# EAGLE design bob (EAGLE 6.4)
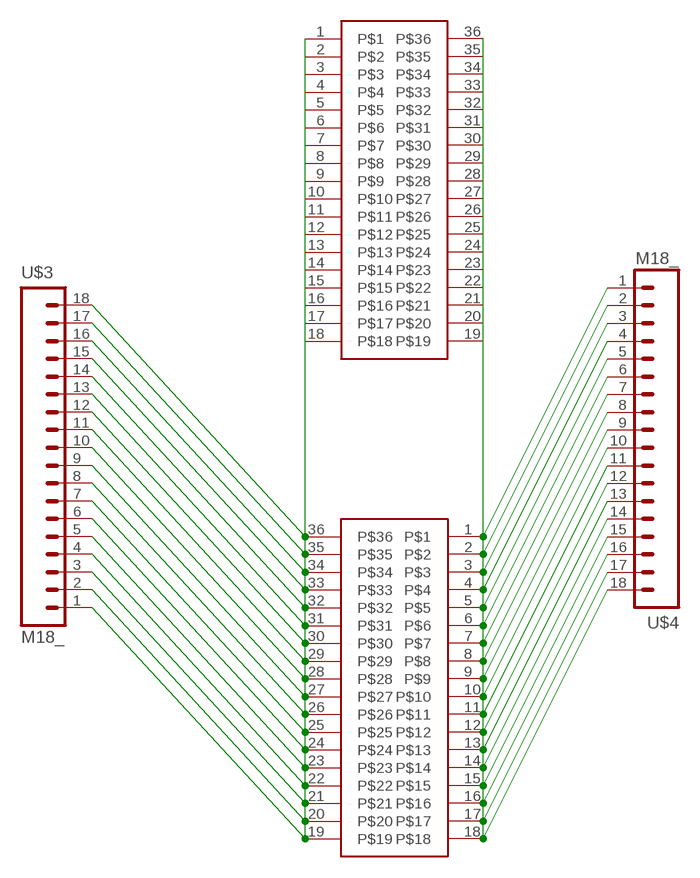
[diagram p0: schematic, sheet 1]

## Parts
U$1  36PIN_BREAKOUTSOIC  [SOIC-8-36-BREAKOUT]
U$2  36PIN_BREAKOUTTSSOP  [TSSOP-8-36-BREAKOUT]
U$3  M18_  [1X18]
U$4  M18_  [1X18]

## Nets
N$1: U$1.17 U$2.20 U$3.2
N$2: U$1.16 U$2.21 U$3.3
N$3: U$1.15 U$2.22 U$3.4
N$4: U$1.14 U$2.23 U$3.5
N$5: U$1.13 U$2.24 U$3.6
N$6: U$1.12 U$2.25 U$3.7
N$7: U$1.11 U$2.26 U$3.8
N$8: U$1.10 U$2.27 U$3.9
N$9: U$1.9 U$2.28 U$3.10
N$10: U$1.8 U$2.29 U$3.11
N$11: U$1.7 U$2.30 U$3.12
N$12: U$1.6 U$2.31 U$3.13
N$13: U$1.5 U$2.32 U$3.14
N$14: U$1.4 U$2.33 U$3.15
N$15: U$1.3 U$2.34 U$3.16
N$16: U$1.2 U$2.35 U$3.17
N$17: U$1.1 U$2.36 U$3.18
N$18: U$1.18 U$2.19 U$3.1
N$19: U$1.35 U$2.2 U$4.2
N$20: U$1.34 U$2.3 U$4.3
N$21: U$1.33 U$2.4 U$4.4
N$22: U$1.32 U$2.5 U$4.5
N$23: U$1.31 U$2.6 U$4.6
N$24: U$1.30 U$2.7 U$4.7
N$25: U$1.29 U$2.8 U$4.8
N$26: U$1.28 U$2.9 U$4.9
N$27: U$1.27 U$2.10 U$4.10
N$28: U$1.26 U$2.11 U$4.11
N$29: U$1.25 U$2.12 U$4.12
N$30: U$1.24 U$2.13 U$4.13
N$31: U$1.23 U$2.14 U$4.14
N$32: U$1.22 U$2.15 U$4.15
N$33: U$1.21 U$2.16 U$4.16
N$34: U$1.20 U$2.17 U$4.17
N$35: U$1.19 U$2.18 U$4.18
N$36: U$1.36 U$2.1 U$4.1

## Library data of the parts
U$1 U$2 = kmod:36PIN_BREAKOUT
U$3 U$4 = SparkFun-Connectors:M18: 1x18 .1" header

## Board
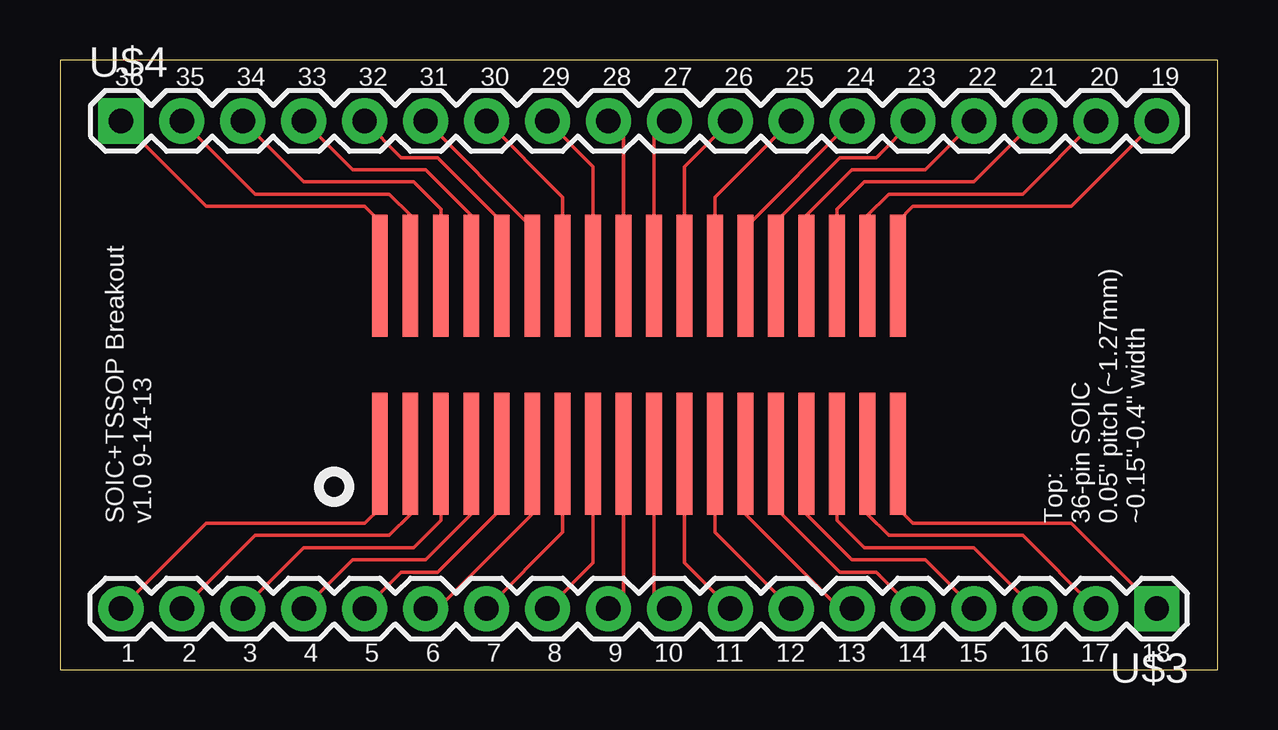
[diagram p1: board, top side]
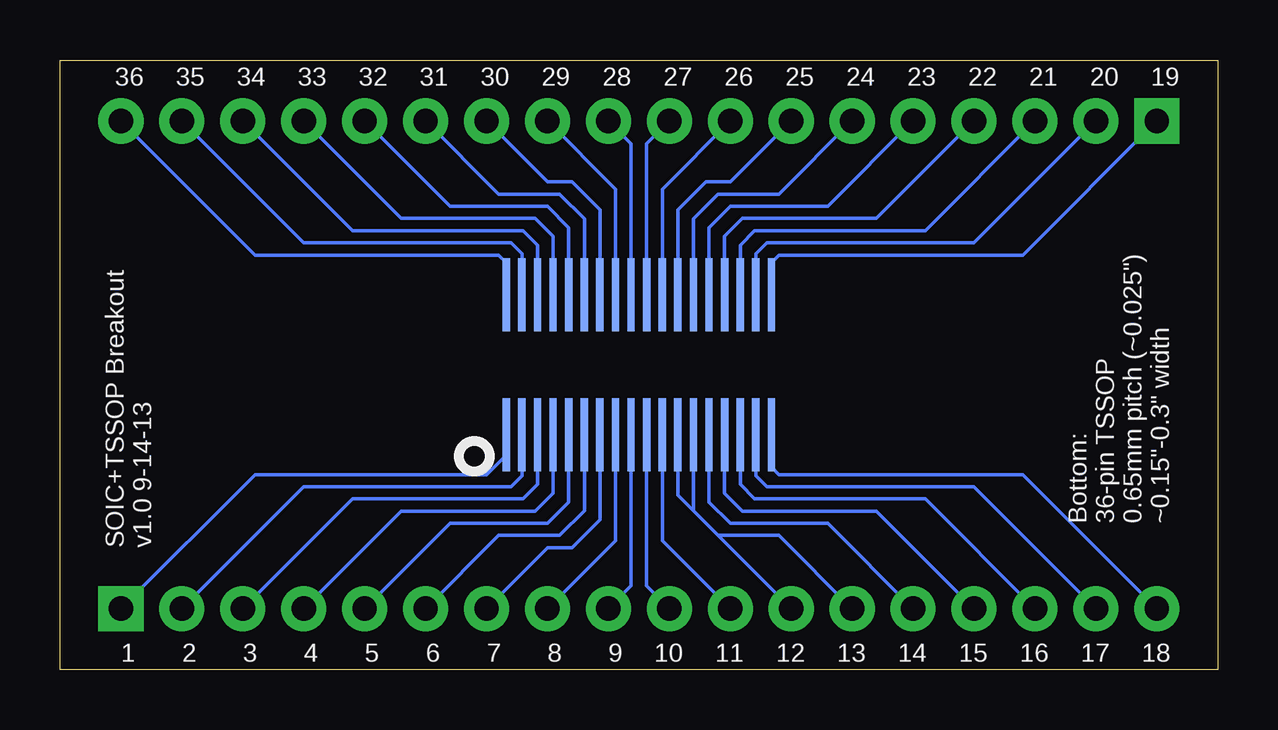
[diagram p2: board, bottom side, seen from below]

Size 48.26 x 25.4 mm. Coordinates in mm from the lower left corner, seen from the top.
Outline: 0,0 48.26,0 48.26,25.4 0,25.39 0,0
Copper layers (1*2*15*16): Top 0.035mm / dielectric 0.2mm / layer 2 0.0175mm / dielectric 1.1mm / layer 15 0.0175mm / dielectric 0.2mm / Bottom 0.035mm
Design rules "SeeedStudio_DRU_no_angle_20130527": minimum track width 6mil, minimum drill 12mil, track to track 6mil, track to pad 6mil, pad to pad 6mil, via to via 6mil, smd to smd 0mil, copper to edge 10mil, drill to drill 10mil, minimum pad ring 6mil, minimum via ring 6mil, stop-mask expansion 2mil, vias tented up to drill 25mil, thermal gap 10mil

### Footprints (pad centres in the part's own frame; a part is rotated, then mirrored left to right if it is on the bottom)
SOIC-8-36-BREAKOUT = smd 0.66 x 5.08: 1 -10.795,-3.708; 2 -9.525,-3.708; 3 -8.255,-3.708; 4 -6.985,-3.708; 5 -5.715,-3.708; 6 -4.445,-3.708; 7 -3.175,-3.708; 8 -1.905,-3.708; 9 -0.635,-3.708; 10 0.635,-3.708; 11 1.905,-3.708; 12 3.175,-3.708; 13 4.445,-3.708; 14 5.715,-3.708; 15 6.985,-3.708; 16 8.255,-3.708; 17 9.525,-3.708; 18 10.795,-3.708; 19 10.795,3.708; 20 9.525,3.708; 21 8.255,3.708; 22 6.985,3.708; 23 5.715,3.708; 24 4.445,3.708; 25 3.175,3.708; 26 1.905,3.708; 27 0.635,3.708; 28 -0.635,3.708; 29 -1.905,3.708; 30 -3.175,3.708; 31 -4.445,3.708; 32 -5.715,3.708; 33 -6.985,3.708; 34 -8.255,3.708; 35 -9.525,3.708; 36 -10.795,3.708
TSSOP-8-36-BREAKOUT = smd 0.305 x 3.048: 1 -5.525,-2.918; 2 -4.875,-2.918; 3 -4.225,-2.918; 4 -3.575,-2.918; 5 -2.925,-2.918; 6 -2.275,-2.918; 7 -1.625,-2.918; 8 -0.975,-2.918; 9 -0.325,-2.918; 10 0.325,-2.918; 11 0.975,-2.918; 12 1.625,-2.918; 13 2.275,-2.918; 14 2.925,-2.918; 15 3.575,-2.918; 16 4.225,-2.918; 17 4.875,-2.918; 18 5.525,-2.918; 19 5.525,2.918; 20 4.875,2.918; 21 4.225,2.918; 22 3.575,2.918; 23 2.925,2.918; 24 2.275,2.918; 25 1.625,2.918; 26 0.975,2.918; 27 0.325,2.918; 28 -0.325,2.918; 29 -0.975,2.918; 30 -1.625,2.918; 31 -2.275,2.918; 32 -2.925,2.918; 33 -3.575,2.918; 34 -4.225,2.918; 35 -4.875,2.918; 36 -5.525,2.918
1X18 = drill 1.016 pad 1.88 square: 1 0,0 | drill 1.016 pad 1.88: 2 2.54,0; 3 5.08,0; 4 7.62,0; 5 10.16,0; 6 12.7,0; 7 15.24,0; 8 17.78,0; 9 20.32,0; 10 22.86,0; 11 25.4,0; 12 27.94,0; 13 30.48,0; 14 33.02,0; 15 35.56,0; 16 38.1,0; 17 40.64,0; 18 43.18,0

### Placement (x,y rotation side)
U$1  24.13,12.7 0 top
U$2  24.13,12.7 180 bottom
U$3  45.72,2.54 180 top
U$4  2.54,22.86 0 top

### Tracks (layer width: path | path; a pad name or v marks a point on that pad's centre or on a via)
N$1
  Top 0.152: U$1.17 33.66,6.48 34.54,5.59 40.13,5.59 U$3.2
  Bottom 0.152: U$2.20 29,8.08 29.46,7.62 38.1,7.62 U$3.2
N$2
  Top 0.152: U$3.3 38.1,5.08 33.53,5.08 32.38,6.22 U$1.16
  Bottom 0.152: U$2.21 28.36,7.71 28.96,7.11 36.07,7.11 U$3.3
N$3
  Top 0.152: U$3.4 36.07,4.57 33.02,4.57 31.11,6.48 U$1.15
  Bottom 0.152: U$2.22 27.7,7.35 28.45,6.6 34.04,6.6 U$3.4
N$4
  Top 0.152: U$3.5 34.04,4.06 32.51,4.06 29.84,6.73 U$1.14
  Bottom 0.152: U$2.23 27.05,6.98 27.94,6.1 32,6.1 U$3.5
N$5
  Top 0.152: U$3.6 32.51,2.54 28.57,6.48 U$1.13
  Bottom 0.152: U$2.24 26.41,6.62 27.43,5.59 29.97,5.59 U$3.6
N$6
  Top 0.152: U$3.7 27.3,5.71 U$1.12
  Bottom 0.152: U$2.25 25.75,6.25 26.92,5.08 27.94,5.08 U$3.7
N$7
  Top 0.152: U$3.8 26.04,4.45 U$1.11
  Bottom 0.152: U$2.26 25.11,5.38 U$3.8
N$8
  Top 0.152: U$3.9 24.77,3.17 U$1.10
  Bottom 0.152: U$2.27 24.45,3.48 U$3.9
N$9
  Top 0.152: U$3.10 23.5,3.17 U$1.9
  Bottom 0.152: U$2.28 23.8,3.48 U$3.10
N$10
  Top 0.152: U$3.11 22.23,4.45 U$1.8
  Bottom 0.152: U$2.29 23.16,5.38 U$3.11
N$11
  Top 0.152: U$3.12 20.95,5.71 U$1.7
  Bottom 0.152: U$2.30 22.5,7.26 U$3.12
N$12
  Top 0.152: U$3.13 15.75,2.54 19.68,6.48 U$1.6
  Bottom 0.152: U$2.31 21.86,6.62 20.83,5.59 18.29,5.59 U$3.13
N$13
  Top 0.152: U$3.14 14.22,4.06 15.75,4.06 18.41,6.73 U$1.5
  Bottom 0.152: U$2.32 21.2,6.98 20.32,6.1 16.26,6.1 U$3.14
N$14
  Top 0.152: U$3.15 12.19,4.57 15.24,4.57 17.14,6.48 U$1.4
  Bottom 0.152: U$2.33 20.55,7.35 19.81,6.6 14.22,6.6 U$3.15
N$15
  Top 0.152: U$3.16 10.16,5.08 14.73,5.08 15.88,6.22 U$1.3
  Bottom 0.152: U$2.34 19.91,7.71 19.3,7.11 12.19,7.11 U$3.16
N$16
  Top 0.152: U$1.2 14.61,6.48 13.72,5.59 8.13,5.59 U$3.17
  Bottom 0.152: U$2.35 19.25,8.08 18.8,7.62 10.16,7.62 U$3.17
N$17
  Top 0.152: U$3.18 6.1,6.1 12.7,6.1 13.34,6.73 U$1.1
  Bottom 0.152: U$2.36 18.61,8.45 18.29,8.13 8.13,8.13 U$3.18
N$18
  Top 0.152: U$3.1 42.16,6.1 35.56,6.1 34.92,6.73 U$1.18
  Bottom 0.152: U$2.19 29.66,8.95 30.48,8.13 40.13,8.13 U$3.1
N$19
  Top 0.152: U$1.35 14.61,18.92 13.72,19.81 8.13,19.81 U$4.2
  Bottom 0.152: U$2.2 19.25,17.32 18.8,17.78 10.16,17.78 U$4.2
N$20
  Top 0.152: U$1.34 15.88,19.18 14.73,20.32 10.16,20.32 U$4.3
  Bottom 0.152: U$2.3 19.91,17.69 19.3,18.29 12.19,18.29 U$4.3
N$21
  Top 0.152: U$1.33 17.14,18.92 15.24,20.83 12.19,20.83 U$4.4
  Bottom 0.152: U$2.4 20.55,18.05 19.81,18.8 14.22,18.8 U$4.4
N$22
  Top 0.152: U$1.32 18.41,18.67 15.75,21.34 14.22,21.34 U$4.5
  Bottom 0.152: U$2.5 21.2,18.42 20.32,19.3 16.26,19.3 U$4.5
N$23
  Top 0.152: U$1.31 19.68,18.41 U$4.6
  Bottom 0.152: U$2.6 21.86,18.79 20.83,19.81 18.29,19.81 U$4.6
N$24
  Top 0.152: U$1.30 20.95,19.68 U$4.7
  Bottom 0.152: U$2.7 22.5,19.15 21.34,20.32 20.32,20.32 U$4.7
N$25
  Top 0.152: U$1.29 22.23,20.95 U$4.8
  Bottom 0.152: U$2.8 23.16,20.02 U$4.8
N$26
  Top 0.152: U$1.28 23.5,22.23 U$4.9
  Bottom 0.152: U$2.9 23.8,21.91 U$4.9
N$27
  Top 0.152: U$1.27 24.77,22.23 U$4.10
  Bottom 0.152: U$2.10 24.45,21.91 U$4.10
N$28
  Top 0.152: U$1.26 26.04,20.95 U$4.11
  Bottom 0.152: U$2.11 25.11,20.02 U$4.11
N$29
  Top 0.152: U$1.25 27.3,19.68 U$4.12
  Bottom 0.152: U$2.12 25.75,19.15 26.92,20.32 27.94,20.32 U$4.12
N$30
  Top 0.152: U$1.24 28.57,18.41 U$4.13
  Bottom 0.152: U$2.13 26.41,18.79 27.43,19.81 29.97,19.81 U$4.13
N$31
  Top 0.152: U$1.23 29.84,18.67 32.51,21.34 34.04,21.34 U$4.14
  Bottom 0.152: U$2.14 27.05,18.42 27.94,19.3 32,19.3 U$4.14
N$32
  Top 0.152: U$1.22 31.11,18.92 33.02,20.83 36.07,20.83 U$4.15
  Bottom 0.152: U$2.15 27.7,18.05 28.45,18.8 34.04,18.8 U$4.15
N$33
  Top 0.152: U$1.21 32.38,19.18 33.53,20.32 38.1,20.32 U$4.16
  Bottom 0.152: U$2.16 28.36,17.69 28.96,18.29 36.07,18.29 U$4.16
N$34
  Top 0.152: U$1.20 33.66,18.92 34.54,19.81 40.13,19.81 U$4.17
  Bottom 0.152: U$2.17 29,17.32 29.46,17.78 38.1,17.78 U$4.17
N$35
  Top 0.152: U$1.19 34.92,18.67 35.56,19.3 42.16,19.3 U$4.18
  Bottom 0.152: U$2.18 29.66,16.95 29.97,17.27 40.13,17.27 U$4.18
N$36
  Top 0.152: U$1.36 13.34,18.67 12.7,19.3 6.1,19.3 U$4.1
  Bottom 0.152: U$2.1 18.61,16.95 18.29,17.27 8.13,17.27 U$4.1

### Text on the board
tPlace: 36 | 35 | 34 | 33 | 32 | 31 | 30 | 29 | 28 | 27 | 26 | 25 | 24 | 23 | 22 | 21 | 20 | 19 | SOIC+TSSOP Breakout / v1.0 9-14-13 | Top: / 36-pin SOIC / 0.05" pitch (~1.27mm) / ~0.15"-0.4" width | 1 | 2 | 3 | 4 | 5 | 6 | 7 | 8 | 9 | 10 | 11 | 12 | 13 | 14 | 15 | 16 | 17 | 18
bPlace: 19 | 20 | 21 | 22 | 23 | 24 | 25 | 26 | 27 | 28 | 29 | 30 | 31 | 32 | 33 | 34 | 35 | 36 | Bottom: / 36-pin TSSOP / 0.65mm pitch (~0.025") / ~0.15"-0.3" width | SOIC+TSSOP Breakout / v1.0 9-14-13 | 18 | 17 | 16 | 15 | 14 | 13 | 12 | 11 | 10 | 9 | 8 | 7 | 6 | 5 | 4 | 3 | 2 | 1